# EAGLE design IRInterface (EAGLE 8.3.2)
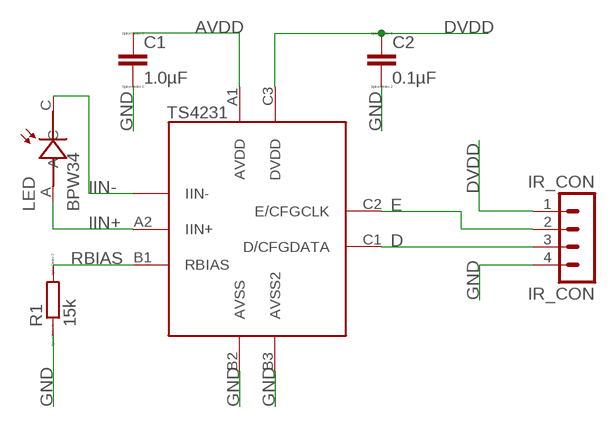
[diagram p0: schematic, sheet 1]

## Parts
C1  1.0µF  CC0402  [C0402]
C2  0.1µF  CC0402  [C0402]
IR_CON  IR_CON  MA04-1  [MA04-1]
LED  BPW34  [PHODET_BPW34]
R1  15k  RR0402  [R0402]
TS4231  TS4231SMD-9  [WLCSP-9]

## Nets
AVDD: C1.1 TS4231.A1(AVDD)
D: IR_CON.3 TS4231.C1(D/CFGDATA)
DVDD: C2.1 IR_CON.1 TS4231.C3(DVDD)
E: IR_CON.2 TS4231.C2(E/CFGCLK)
GND: C1.2 C2.2 IR_CON.4 R1.1 TS4231.B2(AVSS) TS4231.B3(AVSS2)
IIN+: LED.A TS4231.A2(IIN+)
IIN-: LED.C TS4231.A3(IIN-)
RBIAS: R1.2 TS4231.B1(RBIAS)

## Library data of the parts
C1 C2 = eagle-ltspice:C: CAPACITOR, European symbol; SPICEMODEL: NONE; SPICEPREFIX: C
IR_CON = con-lstb:MA04-1: PIN HEADER; OC_FARNELL: unknown; OC_NEWARK: unknown
LED = BPW34:BPW34: PIN IR photodiode; DIL; 400-1100nm; 150mW; 60°; λp max:; AVAILABILITY: Good; DESCRIPTION: 950 nm 100 ns %C2%B1 65%C2%B0 Wide Angle Half Sensitivity TO-5 Silicon PIN Photodiode; MF: Vishay; MP: BPW34; PACKAGE: SMD-2 Vishay; PRICE: 0.62 USD
R1 = eagle-ltspice:R: RESISTOR, European symbol; SPICEMODEL: NONE; SPICEPREFIX: R
TS4231 = SteamVR:TS4231: TS4231 SteamVR™ Tracking Light to Digital Converter with DATA Output

## Board
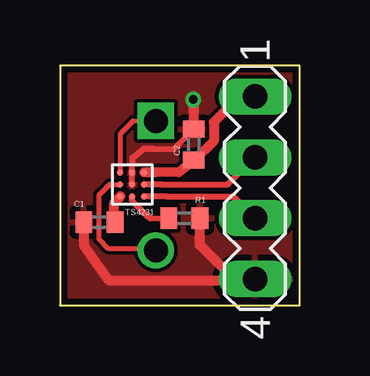
[diagram p1: board, top side]
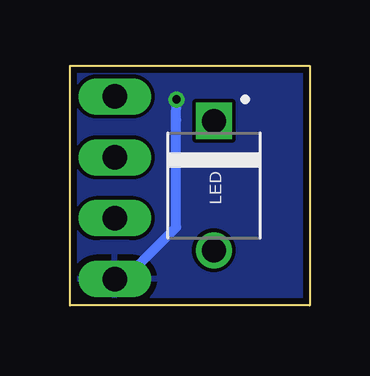
[diagram p2: board, bottom side, seen from below]

Size 10 x 10 mm. Coordinates in mm from the lower left corner, seen from the top.
Outline: 0,0 10,0 10,10 0,10 0,0
Copper layers (1*16): Top 0.035mm / dielectric 1.5mm / Bottom 0.035mm
Design rules "SeeedStudio_2layer_DRU_no_angle_20140221": minimum track width 6mil, minimum drill 12mil, track to track 6mil, track to pad 6mil, pad to pad 6mil, via to via 6mil, smd to smd 0mil, copper to edge 10mil, drill to drill 10mil, minimum pad ring 10mil, minimum via ring 6mil, stop-mask expansion 2mil, vias tented up to drill 100mil, thermal gap 10mil

### Footprints (pad centres in the part's own frame; a part is rotated, then mirrored left to right if it is on the bottom)
C0402 = smd 0.7 x 0.9: 1 -0.65,0; 2 0.65,0
MA04-1 = drill 1.016 long: 1 -3.81,0; 2 -1.27,0; 3 1.27,0; 4 3.81,0
PHODET_BPW34 = drill 1: A 2.7,0 | drill 1 square: C -2.7,0
R0402 = smd 0.7 x 0.9: 1 -0.65,0; 2 0.65,0
WLCSP-9 = smd 0.28 x 0.28: A1 -0.5,0.5; A2 0,0.5; A3 0.5,0.5; B1 -0.5,0; B2 0,0; B3 0.5,0; C1 -0.5,-0.5; C2 0,-0.5; C3 0.5,-0.5

### Placement (x,y rotation side)
C1  1.65,3.48 180 top
C2  5.59,6.71 90 top
IR_CON  8.14,4.91 270 top
LED  4,5 270 bottom
R1  5.19,3.64 180 top
TS4231  3.02,5.05 90 top

### Tracks (layer width: path | path; a pad name or v marks a point on that pad's centre or on a via)
AVDD
  Top 0.152: 2.18,3.59 C1.1
  Top 0.406: 2.18,3.59 2.26,3.92 2.26,4.28 TS4231.A1
D
  Top 0.254: TS4231.C1 4.43,4.55 7.24,4.54 IR_CON.3
DVDD
  Top 0.152: C2.1
  Top 0.406: TS4231.C3 3.97,5.55 4.97,5.56 C2.1 6.42,6.86 6.42,7.64 7.5,8.72 IR_CON.1
E
  Top 0.254: TS4231.C2 4.22,5.05 7.02,5.05 7.02,5.06 IR_CON.2
GND  (via drill 0.35)
  Top 0.152: TS4231.B2
  Top 0.254: 3.89,6.54 | 3.89,6.54 4.76,6.54 C2.2 5.56,7.38 | 3.89,6.54 3.48,6.54 3.02,6.15 3.02,5.85 3.02,5.84 TS4231.B3 TS4231.B2
  Top 0.406: R1.1 5.84,2.52 7.27,1.1 IR_CON.4 7.93,1.05 2.03,1.05 1,2.51 C1.2 | v5.56,8.59 5.56,7.38
  Bottom 0.406: IR_CON.4 7.73,1.1 5.58,3.26 5.58,7.74 v5.56,8.59
  pour Top: 0,10 10,10 10,0 0,0
  pour Bottom: 0,10 10,10 10,0 0,0
IIN+
  Top 0.203: TS4231.A2 2.07,5.05 1.68,4.66 1.63,4.6 1.63,2.78 2.03,2.37 3.71,2.37 LED.A
IIN-
  Top 0.203: TS4231.A3 2.51,5.81 2.51,7.14 3.06,7.71 LED.C
RBIAS
  Top 0.152: 3.02,4.51 TS4231.B1
  Top 0.254: 3.02,4.51 3.02,4.36 3.65,3.74 3.76,3.64 R1.2